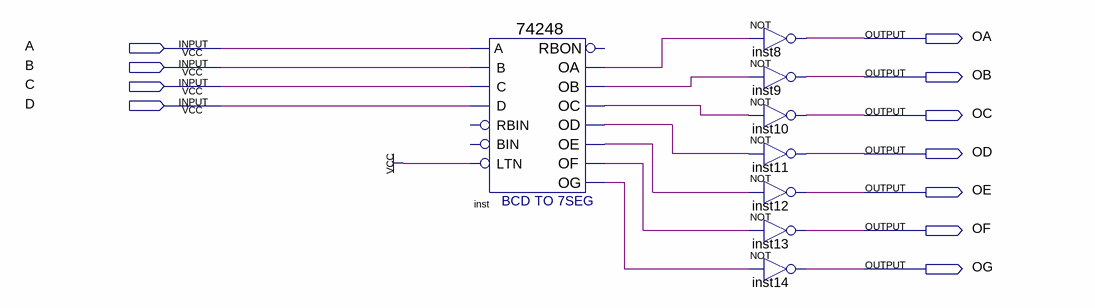
[diagram p0: schematic sheet]
// Quartus schematic bcd7seg.bdf as structural Verilog: 8 symbols, 11 pins
module bcd7seg (
  input  A,
  input  B,
  input  C,
  input  D,
  output OA,
  output OB,
  output OC,
  output OD,
  output OE,
  output OF,
  output OG
);

  wire inst_oa, inst_ob, inst_oc, inst_od, inst_oe, inst_of, inst_og;

  \74248  inst (
    .A(A), .B(B), .D(D), .C(C), .LTN(1'b1), .OG(inst_og), .OD(inst_od), .OE(inst_oe), .OF(inst_of),
    .OA(inst_oa), .OB(inst_ob), .OC(inst_oc));  // open: RBIN, BIN, RBON
  not inst8 (OA, inst_oa);
  not inst9 (OB, inst_ob);
  not inst10 (OC, inst_oc);
  not inst11 (OD, inst_od);
  not inst12 (OE, inst_oe);
  not inst13 (OF, inst_of);
  not inst14 (OG, inst_og);
endmodule
